# EAGLE design arduino_Uno_Rev3-02-TH (EAGLE 5.10)
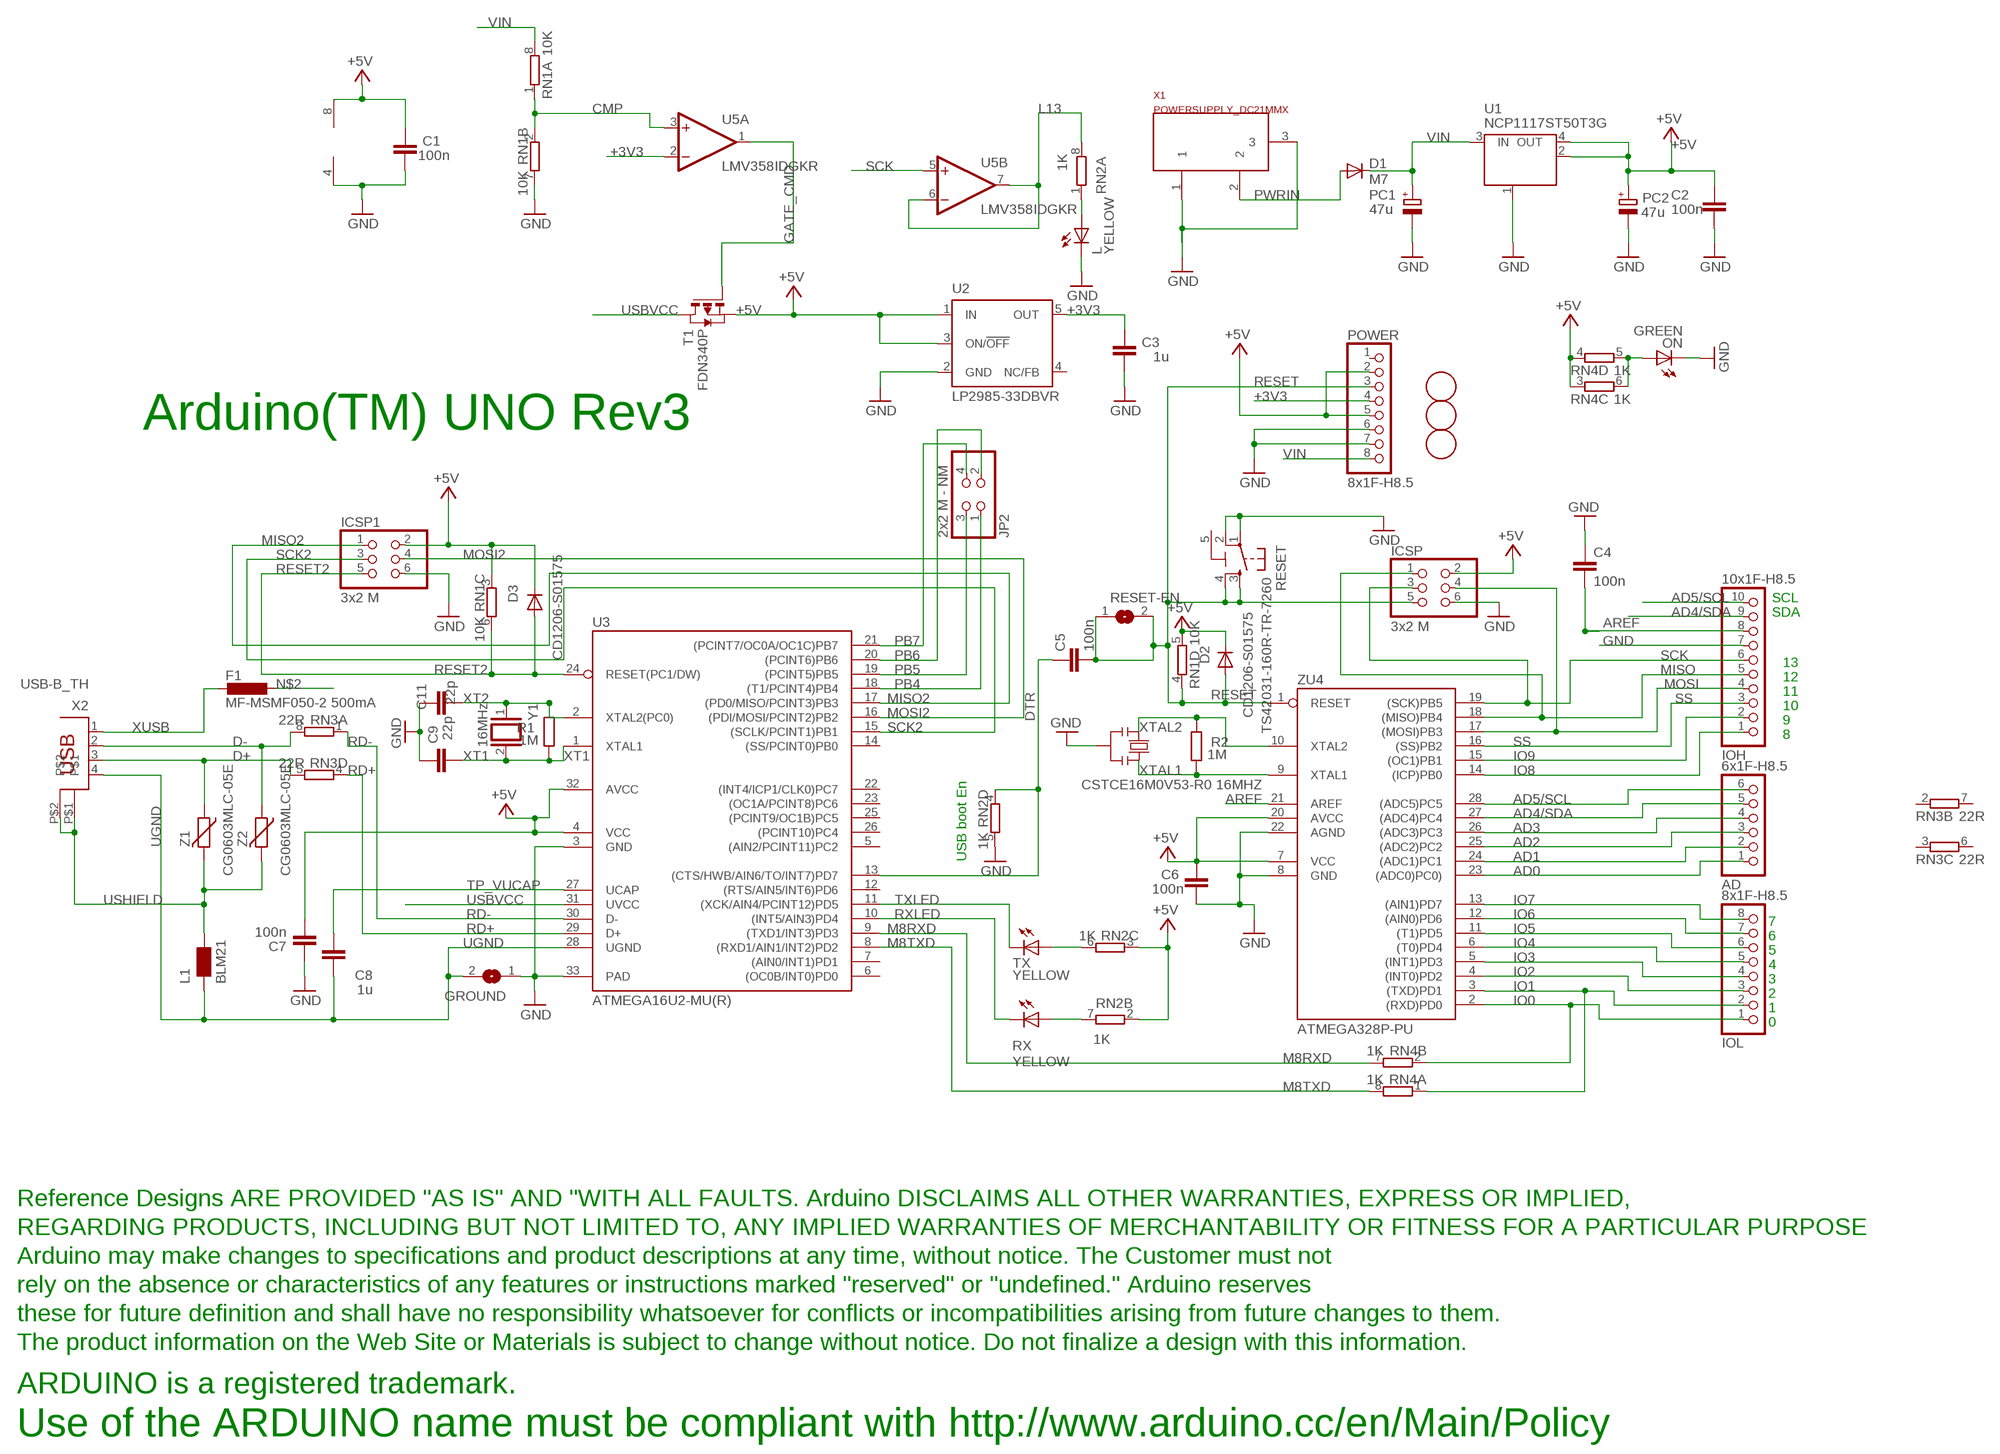
[diagram p0: schematic, sheet 1]

## Parts
AD  6x1F-H8.5  PINHD-1X6  [1X06]
C1  100n  C-EU0603-RND  [C0603-ROUND]
C2  100n  C-EU0603-RND  [C0603-ROUND]
C3  1u  C-EU0603-RND  [C0603-ROUND]
C4  100n  C-EU0603-RND  [C0603-ROUND]
C5  100n  C-EU0603-RND  [C0603-ROUND]
C6  100n  C-EU0603-RND  [C0603-ROUND]
C7  100n  C-EU0603-RND  [C0603-ROUND]
C8  1u  C-EU0603-RND  [C0603-ROUND]
C9  22p  C-EU0603-RND  [C0603-ROUND]
C11  22p  C-EU0603-RND  [C0603-ROUND]
D1  M7  DIODE-SMB  [SMB]
D2  CD1206-S01575  DIODE-MINIMELF  [MINIMELF]
D3  CD1206-S01575  DIODE-MINIMELF  [MINIMELF]
F1  MF-MSMF050-2 500mA  L-EUL1812  [L1812]
FD1  FIDUCIALMOUNT  [FIDUCIA-MOUNT]
FD2  FIDUCIALMOUNT  [FIDUCIA-MOUNT]
FD3  FIDUCIALMOUNT  [FIDUCIA-MOUNT]
GROUND  SJ  [SJ]
ICSP  3x2 M  PINHD-2X3  [2X03]
ICSP1  3x2 M  PINHD-2X3  [2X03]
IOH  10x1F-H8.5  PINHD-1X10_ARD  [1X10]
IOL  8x1F-H8.5  PINHD-1X8  [1X08]
JP2  2x2 M - NM  PINHD-2X2  [2X02]
L  YELLOW  LEDCHIP-LED0805  [CHIP-LED0805]
L1  BLM21  WE-CBF_0805  [0805]
ON  GREEN  LEDCHIP-LED0805  [CHIP-LED0805]
PC1  47u  CPOL-EUD  [PANASONIC_D]
PC2  47u  CPOL-EUD  [PANASONIC_D]
POWER  8x1F-H8.5  PINHD-1X8  [1X08]
R1  1M  R-EU_R0603  [R0603-ROUND]
R2  1M  R-EU_R0603  [R0603-ROUND]
RESET  TS42031-160R-TR-7260  TS42  [TS42]
RESET-EN  SJ  [SJ]
RN1  10K  4R-NCAY16  [CAY16]
RN2  1K  4R-NCAY16  [CAY16]
RN3  22R  4R-NCAY16  [CAY16]
RN4  1K  4R-NCAY16  [CAY16]
RX  YELLOW  LEDCHIP-LED0805  [CHIP-LED0805]
T1  FDN340P  PMOSSOT23  [SOT-23]
TX  YELLOW  LEDCHIP-LED0805  [CHIP-LED0805]
U1  NCP1117ST50T3G  MC33269ST-3.3T3  [SOT223]
U2  LP2985-33DBVR  LP2985-XXDBVR33  [SOT23-DBV]
U3  ATMEGA16U2-MU(R)  ATMEGA16U2-MU  [MLF32]
U5  LMV358IDGKR  LMV358MMX  [MSOP08]
U$1  DISCLAIMER  [DISCLAIMER]
X1  POWERSUPPLY_DC21MMX  [POWERSUPPLY_DC-21MM]
X2  USB-B_TH  PN61729  [PN61729]
Y1  16MHz  XTAL/S  [QS]
Y2  CSTCE16M0V53-R0 16MHZ  RESONATORMU  [RESONATOR]
Z1  CG0603MLC-05E  VARISTORCN0603  [CT/CN0603]
Z2  CG0603MLC-05E  VARISTORCN0603  [CT/CN0603]
ZU4  ATMEGA328P-PU  [DIL28-3]

## Nets
+3V3: C3.2 POWER.4 U2.5(OUT) U5.2(A:-IN)
+5V [usbvcc]: C1.2 C2.2 C6.2 C7.1 D2.C D3.C ICSP1.2 ICSP.2 PC2.+ POWER.2 POWER.5 RN1.3 RN1.5 RN2.2 RN2.3 RN4.3 RN4.4 T1.2(S) U1.2(OUT) U1.4(OUT) U2.1(IN) U2.3(ON/!OFF) U3.4(VCC) U3.32(AVCC) U5.8(P:V+) ZU4.7(VCC) ZU4.20(AVCC)
AD0: AD.1 ZU4.23((ADC0)PC0))
AD1: AD.2 ZU4.24((ADC1)PC1)
AD2: AD.3 ZU4.25((ADC2)PC2)
AD3: AD.4 ZU4.26((ADC3)PC3)
AD4/SDA: AD.5 IOH.9 ZU4.27((ADC4)PC4)
AD5/SCL: AD.6 IOH.10 ZU4.28((ADC5)PC5)
AREF [aref]: C4.2 IOH.8 ZU4.21(AREF)
CMP: RN1.1 RN1.2 U5.3(A:+IN)
D+: RN3.5 X2.3 Z1.1
D-: RN3.8 X2.2 Z2.1
DTR: C5.1 RN2.4 U3.13((CTS/HWB/AIN6/TO/INT7)PD7)
GATE_CMD: T1.3(G) U5.1(A:OUT)
GND [gnd]: C1.1 C2.1 C3.1 C4.1 C6.1 C7.2 C9.2 C11.2 GROUND.1 ICSP1.6 ICSP.6 IOH.7 L.C ON.C PC1.- PC2.- POWER.6 POWER.7 RESET.1 RESET.2 RN1.7 RN2.5 U1.1(GND/ADJ) U2.2(GND) U3.3(GND) U3.33(PAD) U5.4(P:V-) X1.1 X1.3 Y2.2 ZU4.8(GND) ZU4.22(AGND)
IO0: IOL.1 RN4.2 ZU4.2((RXD)PD0)
IO1: IOL.2 RN4.1 ZU4.3((TXD)PD1)
IO2: IOL.3 ZU4.4((INT0)PD2)
IO3: IOL.4 ZU4.5((INT1)PD3)
IO4: IOL.5 ZU4.6((T0)PD4)
IO5: IOL.6 ZU4.11((T1)PD5)
IO6: IOL.7 ZU4.12((AIN0)PD6)
IO7: IOL.8 ZU4.13((AIN1)PD7)
IO8: IOH.1 ZU4.14((ICP)PB0)
IO9: IOH.2 ZU4.15((OC1)PB1)
L13: RN2.8 U5.6(B:-IN) U5.7(B:OUT)
M8RXD: RN4.7 U3.9((TXD1/INT3)PD3)
M8TXD: RN4.8 U3.8((RXD1/AIN1/INT2)PD2)
MISO: ICSP.1 IOH.5 ZU4.18((MISO)PB4)
MISO2: ICSP1.1 U3.17((PD0/MISO/PCINT3)PB3)
MOSI: ICSP.4 IOH.4 ZU4.17((MOSI)PB3)
MOSI2: ICSP1.4 U3.16((PDI/MOSI/PCINT2)PB2)
N$1: L.A RN2.1
N$2 [usbvcc]: F1.1
N$3: ON.A RN4.5 RN4.6
N$35: RN2.7 RX.A
N$36: RN2.6 TX.A
PB4: JP2.1 U3.18((T1/PCINT4)PB4)
PB5: JP2.3 U3.19((PCINT5)PB5)
PB6: JP2.2 U3.20((PCINT6)PB6)
PB7: JP2.4 U3.21((PCINT7/OC0A/OC1C)PB7)
PWRIN [power]: D1.A X1.2
RD+: RN3.4 U3.29(D+)
RD-: RN3.1 U3.30(D-)
RESET: C5.2 D2.A ICSP.5 POWER.3 RESET-EN.1 RESET-EN.2 RESET.3 RESET.4 RN1.4 ZU4.1(RESET)
RESET2: D3.A ICSP1.5 RN1.6 U3.24(RESET(PC1/DW))
RXLED: RX.C U3.10((INT5/AIN3)PD4)
SCK: ICSP.3 IOH.6 U5.5(B:+IN) ZU4.19((SCK)PB5)
SCK2: ICSP1.3 U3.15((SCLK/PCINT1)PB1)
SS: IOH.3 ZU4.16((SS)PB2)
TP_VUCAP: C8.1 U3.27(UCAP)
TXLED: TX.C U3.11((XCK/AIN4/PCINT12)PD5)
UGND [gnd]: C8.2 GROUND.2 L1.1 U3.28(UGND) X2.4
USBVCC [usbvcc]: T1.1(D) U3.31(UVCC)
USHIELD [gnd]: L1.2 X2.P$1 X2.P$2 Z1.2 Z2.2
VIN [power]: D1.C PC1.+ POWER.8 RN1.8 U1.3(IN)
XT1: C9.1 R1.1 U3.1(XTAL1) Y1.2
XT2: C11.1 R1.2 U3.2(XTAL2(PC0)) Y1.1
XTAL1: R2.1 Y2.3 ZU4.9(XTAL1)
XTAL2: R2.2 Y2.1 ZU4.10(XTAL2)
XUSB [usbvcc]: F1.2 X2.1
Unconnected: POWER.1 RN3.2 RN3.3 RN3.6 RN3.7 U2.4(NC/FB) U3.5((AIN2/PCINT11)PC2) U3.6((OC0B/INT0)PD0) U3.7((AIN0/INT1)PD1) U3.12((RTS/AIN5/INT6)PD6) U3.14((SS/PCINT0)PB0) U3.22((INT4/ICP1/CLK0)PC7) U3.23((OC1A/PCINT8)PC6) U3.25((PCINT9/OC1B)PC5) U3.26((PCINT10)PC4)

## Notes on the sheet
- Arduino(TM) UNO Rev3
- SCL
- SDA
- 13
- 12
- 11
- 10
- 9
- 8
- USB boot En
- 7
- 6
- 5
- 4
- 3
- 2
- 1
- 0
- Use of the ARDUINO name must be compliant with http://www.arduino.cc/en/Main/Policy

## Power pins joined to a net without a drawn wire
5-GND: RESET.5(5-GND)

## Library data of the parts
AD = SmartPrj:PINHD-1X6: PIN HEADER
C1-C9 C11 = SmartPrj:C-EU: CAPACITOR, European symbol
D1-D3 = diode:DIODE-: DIODE
F1 = rcl:L-EU: INDUCTOR, European symbol
FD1-FD3 = SmartPrj:FIDUCIALMOUNT
GROUND RESET-EN = jumper:SJ: SMD solder JUMPER
ICSP ICSP1 = SmartPrj:PINHD-2X3: PIN HEADER
IOH = SmartPrj:PINHD-1X10_ARD: PIN HEADER
IOL POWER = SmartPrj:PINHD-1X8: PIN HEADER
JP2 = SmartPrj:PINHD-2X2: PIN HEADER
L ON RX TX = led:LED: LED OSRAM: - CHIPLED LG R971, LG N971, LY N971, LG Q971, LY Q971, LO R971, LY R971 LH N974, LH R974 LS Q976, LO Q976, LY Q976 LO Q996 - Hyper CHIPLED LW Q18S LB Q993, LB Q99A, LB R99A - SideLED LS A670, LO A670, LY A670, LG A670, LP A670 LB A673, LV A673, LT A673, LW A673 LH A674 LY A675 LS A676, LA A676, LO A676, LY A676, LW A676 LS A679, LY A679, LG A679 - Hyper Micro SIDELED® LS Y876, LA Y876, LO Y876, LY Y876 LT Y87S - SmartLED LW L88C, LW L88S LB L89C, LB L89S, LG L890 LS L89K, LO L89K, LY L89K LS L896, LA L896, LO L896, LY L896 - TOPLED LS T670, LO T670, LY T670, LG T670, LP T670 LSG T670, LSP T670, LSY T670, LOP T670, LYG T670 LG T671, LOG T671, LSG T671 LB T673, LV T673, LT T673, LW T673 LH T674 LS T676, LA T676, LO T676, LY T676, LB T676, LH T676, LSB T676, LW T676 LB T67C, LV T67C, LT T67C, LS T67K, LO T67K, LY T67K, LW E67C LS E67B, LA E67B, LO E67B, LY E67B, LB E67C, LV E67C, LT E67C LW T67C LS T679, LY T679, LG T679 LS T770, LO T770, LY T770, LG T770, LP T770 LB T773, LV T773, LT T773, LW T773 LH T774 LS E675, LA E675, LY E675, LS T675 LS T776, LA T776, LO T776, LY T776, LB T776 LHGB T686 LT T68C, LB T68C - Hyper Mini TOPLED® LB M676 - Mini TOPLED Santana® LG M470 LS M47K, LO M47K, LY M47K Source: http://www.osram.convergy.de LUXEON: - LUMILED® LXK2-PW12-R00, LXK2-PW12-S00, LXK2-PW14-U00, LXK2-PW14-V00 LXK2-PM12-R00, LXK2-PM12-S00, LXK2-PM14-U00 LXK2-PE12-Q00, LXK2-PE12-R00, LXK2-PE12-S00, LXK2-PE14-T00, LXK2-PE14-U00 LXK2-PB12-K00, LXK2-PB12-L00, LXK2-PB12-M00, LXK2-PB14-N00, LXK2-PB14-P00, LXK2-PB14-Q00 LXK2-PR12-L00, LXK2-PR12-M00, LXK2-PR14-Q00, LXK2-PR14-R00 LXK2-PD12-Q00, LXK2-PD12-R00, LXK2-PD12-S00 LXK2-PH12-R00, LXK2-PH12-S00 LXK2-PL12-P00, LXK2-PL12-Q00, LXK2-PL12-R00 Source: www.luxeon.com KINGBRIGHT: KA-3528ASYC Source: www.kingbright.com
L1 = wuerth-elektronik:WE-CBF: SMD EMI Suppression Ferrite Beads - excellent anti-EMI properties - low DCR - impedances till 3000 ohms - rated current up to 6 A
PC1 PC2 = rcl:CPOL-EU: POLARIZED CAPACITOR, European symbol
R1 R2 = SmartPrj:R-EU_: RESISTOR, European symbol
RESET = SmartPrj:TS42: TS42 Dongnan Electronics Tact switch VDC 12V - 50mA
RN1-RN4 = resistor-dil:4R-N: Array Chip Resistor Source: RS Component / Phycomp
T1 = zetex:PMOSSOT23: MOS FET
U1 = linear:MC33269ST*: Adjustable Output Low Dropout Voltage Regulator 800 mA Source: http://www.onsemi.com/pub/Collateral/MC33269-D.PDF
U2 = SmartPrj:LP2985-XXDBVR: ULTRALOW-POWER 50-mA LOW-DROPOUT LINEAR REGULATORS 50-mA Low-Dropout Regulator Source: http://focus.ti.com/lit/ds/symlink/tps77001.pdf
U3 = SmartPrj:ATMEGA16U2-
U5 = linear:LMV358?*: Dual General Purpose, Low Voltage, Rail-to-Rail Output Operational Amplifiers Source: http://www.national.com/mpf/LM/LMV321.html http://www.national.com/dt/lmv_qual.pdf
U$1 = SmartPrj:DISCLAIMER
X1 = SmartPrj:POWERSUPPLY_DC21MM
X2 = SmartPrj:PN61729: BERG USB connector
Y1 = SmartPrj:XTAL/S: CRYSTAL
Y2 = SmartPrj:RESONATOR
Z1 Z2 = varistor:VARISTOR: VARISTOR
ZU4 = SmartPrj:ATMEGA328P-: MICROCONTROLLER 4 Kbytes FLASH 128 bytes SRAM 256 bytes EEPROM UART 6-channel 10 bit ADC

## Net classes
0 default: width 0.254 mm, clearance 0.254 mm
1 power: width 0.61 mm, drill 0.61 mm, clearance 0.254 mm
2 gnd: width 0.305 mm, drill 0.559 mm, clearance 0.254 mm
3 usbvcc: width 0.508 mm, drill 0.61 mm, clearance 0.254 mm
4 aref: width 0.406 mm, drill 0.61 mm, clearance 0.254 mm

## Board
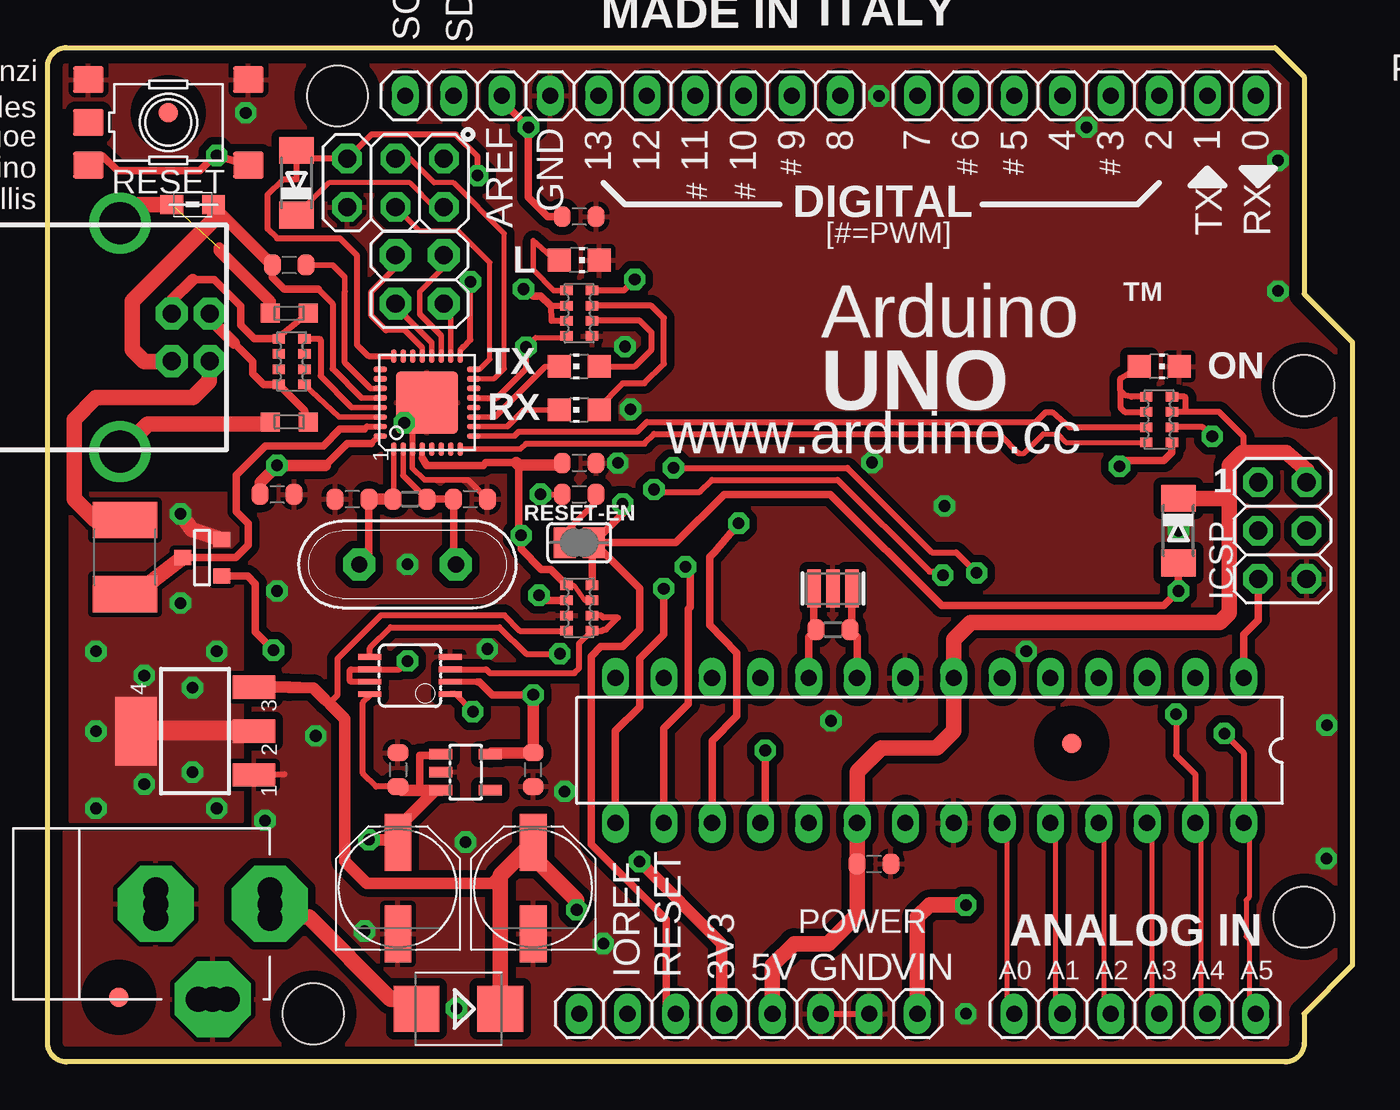
[diagram p1: board, top side]
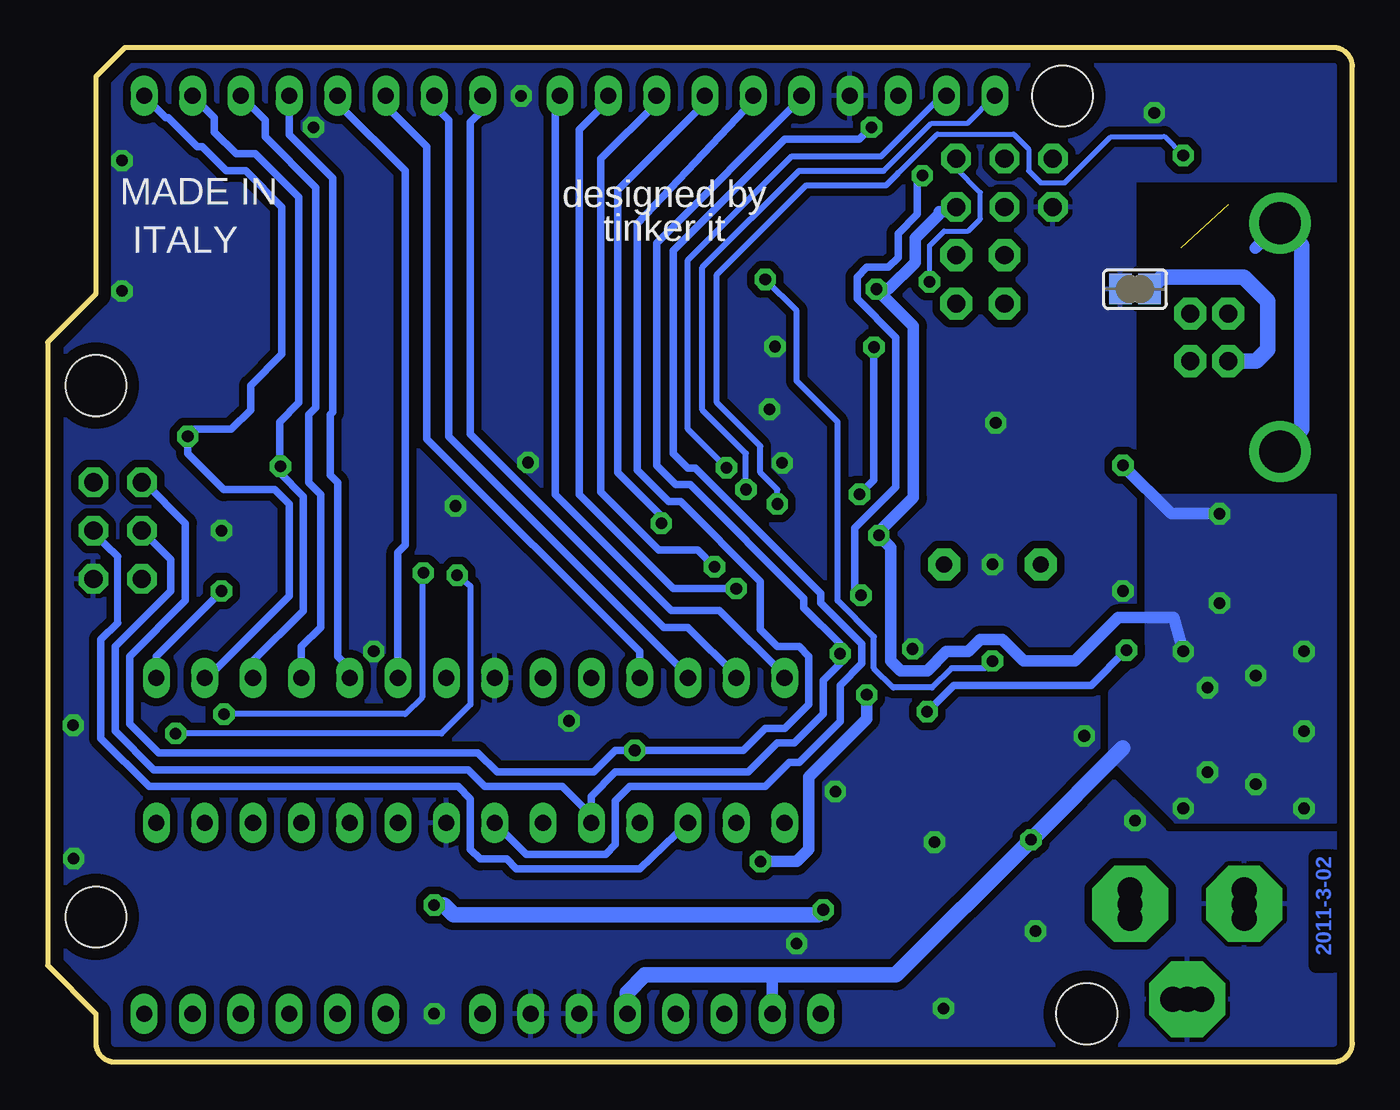
[diagram p2: board, bottom side, seen from below]

Size 68.58 x 53.34 mm. Coordinates in mm from the lower left corner, seen from the top.
Outline: 64.52,53.34 66.04,51.82 66.04,40.39 68.58,37.85 68.58,5.08 66.04,2.54 66.04,1 arc-90 65.04,0 1,0 arc-90 0,1 0,52.34 arc-90 1,53.34 64.52,53.34
Copper layers (1*16): Top 0.035mm / dielectric 1.5mm / Bottom 0.035mm
Design rules "ArduinoUno *": minimum track width 10mil, minimum drill 22mil, track to track 10mil, track to pad 10mil, pad to pad 10mil, via to via 12mil, smd to smd 8mil, copper to edge 26mil, drill to drill 12mil, minimum pad ring 10mil, minimum via ring 10mil, stop-mask expansion 1mil, vias tented up to drill 30mil, thermal gap 10mil
Holes 3.2 mm at 66.04,35.56 66.04,7.62 15.24,50.8 13.97,2.54
vRestrict: area 22.9,44.1 to 24.6,49.1; area 25.4,45.5 to 27.1,49.1; area 28.4,45.3 to 29.6,48.8; area 31,45.3 to 32.1,48.8; area 33.5,45.3 to 34.7,48.8; area 36.1,45.3 to 37.2,48.8; area 38.7,47.2 to 39.9,48.8; area 40.3,45.1 to 47.6,46.9; area 60.3,44.2 to 61.7,46.7; area 62.9,44.2 to 64.3,46.7; area 61.3,35.8 to 64.8,37.2; area 0.6,21.8 to 2,30.1; area 5.7,22.6 to 7.4,30.1; area 47.9,10.3 to 48.5,10.8; area 50.4,10.2 to 50.9,11; area 11.3,28.8 to 12.7,31.1; area 44.8,47.5 to 46.1,48.9; area 47.6,47.4 to 48.8,48.9; area 50.2,47.4 to 51.3,48.9; area 52.8,47.4 to 54,48.9; area 55.2,47.4 to 56.4,48.9; area 57.9,47.4 to 59.1,48.9; area 60.5,47.4 to 61.6,48.9; area 63,47.4 to 64.1,48.9; area 41.3,47.2 to 42.4,48.8; area 0.3,12.4 to 9.4,24.5

### Footprints (pad centres in the part's own frame; a part is rotated, then mirrored left to right if it is on the bottom)
1X06 = drill 0.85 pad 1.422 long: 1 -6.35,0; 2 -3.81,0; 3 -1.27,0; 4 1.27,0; 5 3.81,0; 6 6.35,0
C0603-ROUND = smd 0.898 x 1.1: 1 -0.889,0; 2 0.889,0
SMB = smd 2.4 x 2.4: A 2.2,0; C -2.2,0
MINIMELF = smd 1.4 x 1.8: A 1.7,0; C -1.7,0
L1812 = smd 1.9 x 3.4: 1 -1.95,0; 2 1.95,0
FIDUCIA-MOUNT = smd 1.016 x 1.016: P$1 0,0
SJ = smd 1.168 x 1.6: 1 -0.762,0; 2 0.762,0
2X03 = drill 0.95 pad 1.55 octagon: 1 -2.54,-1.27; 2 -2.54,1.27; 3 0,-1.27; 4 0,1.27; 5 2.54,-1.27; 6 2.54,1.27
1X10@1 = drill 0.85 pad 1.422 long: 1 -11.43,0; 2 -8.89,0; 3 -6.35,0; 4 -3.81,0; 5 -1.27,0; 6 1.27,0; 7 3.81,0; 8 6.35,0; 9 8.89,0; 10 11.43,0
1X08 = drill 0.85 pad 1.422 long: 1 -8.89,0; 2 -6.35,0; 3 -3.81,0; 4 -1.27,0; 5 1.27,0; 6 3.81,0; 7 6.35,0; 8 8.89,0
2X02 = drill 0.95 pad 1.676 octagon: 1 -1.27,-1.27; 2 -1.27,1.27; 3 1.27,-1.27; 4 1.27,1.27
CHIP-LED0805 = smd 1.2 x 1.2: A 0,-1.05; C 0,1.05
0805 = smd 1.2 x 1: 1 -1.1,0; 2 1.1,0
PANASONIC_D = smd 3 x 1.4: + 2.4,0; - -2.4,0
R0603-ROUND = smd 0.898 x 1.1: 1 -0.889,0; 2 0.889,0
TS42 = smd 1.6 x 1.4: 1 -4.2,2.25; 2 4.2,2.25; 3 -4.2,-2.25; 4 4.2,-2.25; 5 -4.2,0
CAY16 = smd 0.5 x 0.65: 1 -1.2,-0.675; 2 -0.4,-0.675; 3 0.4,-0.675; 4 1.2,-0.675; 5 1.2,0.675; 6 0.4,0.675; 7 -0.4,0.675; 8 -1.2,0.675
SOT-23 = smd 0.787 x 0.889: 1 0.025,-1.016; 2 -0.94,1.016; 3 0.991,1.016
SOT223 = smd 1.219 x 2.235: 1 -2.311,-3.099; 2 0,-3.099; 3 2.311,-3.099 | smd 3.6 x 2.2: 4 0,3.099
SOT23-DBV = smd 0.55 x 1.2: 1 -0.95,-1.3; 2 0,-1.3; 3 0.95,-1.3; 4 0.95,1.3; 5 -0.95,1.3
MLF32 = smd 0.7 x 0.28: 1 -2.45,1.75; 2 -2.45,1.25; 3 -2.45,0.75; 4 -2.45,0.25; 5 -2.45,-0.25; 6 -2.45,-0.75; 7 -2.45,-1.25; 8 -2.45,-1.75; 17 2.45,-1.75; 18 2.45,-1.25; 19 2.45,-0.75; 20 2.45,-0.25; 21 2.45,0.25; 22 2.45,0.75; 23 2.45,1.25; 24 2.45,1.75 | smd 0.28 x 0.7: 9 -1.75,-2.45; 10 -1.25,-2.45; 11 -0.75,-2.45; 12 -0.25,-2.45; 13 0.25,-2.45; 14 0.75,-2.45; 15 1.25,-2.45; 16 1.75,-2.45; 25 1.75,2.45; 26 1.25,2.45; 27 0.75,2.45; 28 0.25,2.45; 29 -0.25,2.45; 30 -0.75,2.45; 31 -1.25,2.45; 32 -1.75,2.45 | smd 3.254 x 3.254: 33 0,0
MSOP08 = smd 0.3 x 1.2: 1 -0.976,-2.113; 2 -0.326,-2.113; 3 0.324,-2.113; 4 0.974,-2.113; 5 0.974,2.112; 6 0.324,2.112; 7 -0.326,2.112; 8 -0.976,2.112
POWERSUPPLY_DC-21MM = drill 1.3 pad 4 octagon: 1 -5.08,-3.353; 2 -0.076,-6.35; 3 -0.076,-0.356 | drill 1.3 round: 4 -5.08,-4.115; 5 -5.08,-2.591; 6 -0.838,-0.356; 7 0.686,-0.356; 8 -0.838,-6.35; 9 0.686,-6.35
PN61729 = drill 0.95 pad 1.676 octagon: 1 1.25,4.71; 2 -1.25,4.71; 3 -1.25,2.71; 4 1.25,2.71 | drill 2.2 round: P$1 -6,0; P$2 6,0
QS = drill 0.85 pad 1.676 octagon: 1 -2.54,0; 2 2.54,0
RESONATOR = smd 0.7 x 2: 1 -1,0; 2 0,0; 3 1,0
CT/CN0603 = smd 1 x 1: 1 -1,0; 2 1,0
DIL28-3 = drill 0.85 pad 1.422 long: 1 -16.51,-3.81; 2 -13.97,-3.81; 3 -11.43,-3.81; 4 -8.89,-3.81; 5 -6.35,-3.81; 6 -3.81,-3.81; 7 -1.27,-3.81; 8 1.27,-3.81; 9 3.81,-3.81; 10 6.35,-3.81; 11 8.89,-3.81; 12 11.43,-3.81; 13 13.97,-3.81; 14 16.51,-3.81; 15 16.51,3.81; 16 13.97,3.81; 17 11.43,3.81; 18 8.89,3.81; 19 6.35,3.81; 20 3.81,3.81; 21 1.27,3.81; 22 -1.27,3.81; 23 -3.81,3.81; 24 -6.35,3.81; 25 -8.89,3.81; 26 -11.43,3.81; 27 -13.97,3.81; 28 -16.51,3.81

### Placement (x,y rotation side)
AD  57.15,2.54 0 top
C1  18.41,15.37 270 top
C2  12.06,29.84 180 top
C3  25.53,15.37 90 top
C4  27.94,44.45 180 top
C5  27.94,29.84 0 top
C6  43.43,10.41 180 top
C7  27.94,31.5 0 top
C8  12.7,41.91 180 top
C9  16,29.59 180 top
C11  22.23,29.59 0 top
D1  21.59,2.79 180 top
D2  59.44,27.94 270 top
D3  13.08,46.23 90 top
F1  4.06,26.54 90 top
FD1  6.35,49.91 0 top
FD2  53.84,16.74 0 top
FD3  3.73,3.41 0 top
GROUND  11.43,40.64 0 bottom
ICSP  64.9,27.94 270 top
ICSP1  18.29,46.23 180 top
IOH  10x1F-H8.5  [1X10@1]  30.23,50.8 180 top
IOL  54.61,50.8 180 top
JP2  19.56,41.15 90 top
L  27.94,42.16 270 top
L1  7.62,45.09 180 top
ON  58.42,36.58 270 top
PC1  25.53,9.14 90 top
PC2  18.41,9.14 90 top
POWER  36.83,2.54 0 top
R1  19.05,29.59 0 top
R2  41.27,22.73 180 top
RESET  6.35,49.4 0 top
RESET-EN  27.94,27.3 0 top
RN1  27.94,23.88 90 top
RN2  27.94,39.37 270 top
RN3  12.83,36.83 90 top
RN4  58.42,33.78 90 top
RX  27.94,34.29 90 top
T1  8.13,26.54 270 top
TX  27.94,36.58 90 top
U1  7.75,17.4 90 top
U2  21.97,15.24 270 top
U3  19.94,34.67 90 top
U5  19.05,20.32 90 top
U$1  -20.19,-23.37 0 top  (outside the outline)
X1  5.33,8.38 90 top
X2  3.81,38.1 270 top
Y1  18.92,26.16 180 top
Y2  41.27,24.89 0 top
Z1  12.7,39.37 180 top
Z2  12.7,33.66 180 top
ZU4  46.35,16.38 180 top

### Tracks (layer width: path | path; a pad name or v marks a point on that pad's centre or on a via)
+3V3  (via drill 0.61)
  Top 0.305: 22.61,19.99 U5.2
  Top 0.406: 22.61,19.99 22.68,19.99 23.37,19.3 v25.53,19.3
  Top 0.61: v31.11,10.54 35.43,6.22 35.43,2.67 POWER.4 | U2.5 23.34,16.26 C3.2 v25.53,19.3
  Bottom 0.61: v31.11,10.54 29.21,10.54 28.57,11.18 28.57,14.99 25.53,18.03 v25.53,19.3
+5V  (via drill 0.61)
  Top 0.254: 27.32,25.02 RN1.5 27.65,25.08 28.23,24.28 RN1.3 | ICSP1.2 20.32,44.96 19.05,46.23 14.78,46.23 D3.C
  Top 0.305: 59.82,34.18 61.58,34.18 62.87,32.89 62.87,32.05 | 59.82,34.18 RN4.3 | RN4.4 59.76,34.98 59.82,34.92 59.82,34.18 | RN2.2 26.43,39.77 26.47,38.97 RN2.3 | 19.69,31.75 U3.4 | U3.32 17.43,32.92 17.02,32.51 | U5.8 16.98,19.3 16.57,18.9 16.57,15.18 17.27,14.48 C1.2
  Top 0.406: 42.55,10.16 42.35,10.35 | 26.43,39.77 25.93,40.28 25.53,40.26 v25.02,40.64 | RN1.5 26.43,25.91 25.96,25.91 24.89,26.97 v24.89,27.69 24.77,28.19 24.77,31.38 | 24.64,31.51 23.03,31.51 22.89,31.37 19.94,31.37 19.69,31.75 | 17.02,32.51 15.75,32.51 14.61,31.37 | U2.1 20.61,16.13 19.56,16.13 19.56,14.29
  Top 0.508: 11.02,17.42 U1.2 | ICSP.2 66.04,30.48
  Top 0.61: C6.2 42.58,10.88 42.55,11.43 | 24.64,31.51 24.77,31.38 26.94,31.38 C7.1 | 11.05,29.72 C2.2 11.18,30.48 v12.06,31.37 14.61,31.37 | v16.89,11.68 18.78,11.68 PC2.+ 18.41,12.32 20.39,14.29 U2.3 19.56,14.29 18.6,14.29 C1.2
  Top 0.813: 66.17,30.44 ICSP.2 66.17,31.11 65.1,32.05 62.87,32.05 62.79,32.05 62.1,31.37 62.1,29.46 | 62.1,29.46 62.1,23.62 61.59,23.11 48.51,23.11 47.62,22.23 ZU4.7 47.62,17.4 46.74,16.51 43.81,16.51 42.55,15.24 ZU4.20 42.55,11.43 C6.2 42.55,10.16 42.55,7.75 41.02,6.22 39.24,6.22 38.1,5.08 POWER.5 | T1.2 7.57,27.99 v6.99,28.83 | D2.C 61.93,29.64 62.1,29.46
  Top 1.016: U1.4 5.84,17.4 5.87,17.42 11.02,17.42
  Bottom 0.61: ICSP1.2 21.08,44.7 21.72,44.7 21.72,44.58 22.99,43.31 22.99,42.04 24.38,40.64 v25.02,40.64 23.07,38.69 23.07,29.68 24.89,27.85 v24.89,27.69 24.26,27.05 24.26,21.08 23.75,20.57 22.35,20.57 21.34,21.59 20.19,21.59 19.56,22.23 18.41,22.23 17.27,21.08 14.61,21.08 12.32,23.37 9.4,23.37 v8.89,21.59 | POWER.2 30.48,4.7 30.61,4.57 | v12.06,31.37 9.53,28.83 v6.99,28.83
  Bottom 0.813: POWER.5 38.12,3.63 37.19,4.57 30.61,4.57 24,4.57 v16.89,11.68 12.06,16.51
  other vias: 2.54,21.59 5.08,20.32 6.99,24.13 2.54,13.34 5.08,14.61 2.54,17.4 8.89,13.34 7.62,15.24 7.62,19.68
  pour Bottom (isolate 0.406, no thermals): 0.89,29.72 10.79,29.72 10.79,21.34 12.7,19.43 12.7,16.13 9.27,12.7 0.89,12.7
  pour Top (no thermals): 1.27,12.7 1.27,29.84 10.16,29.84 10.16,12.7
AD0
  Top 0.254: ZU4.23 50.44,12.17 50.44,3 AD.1
AD1
  Top 0.254: ZU4.24 52.98,12.17 52.98,3 AD.2
AD2
  Top 0.254: ZU4.25 55.52,12.17 55.52,3 AD.3
AD3
  Top 0.254: ZU4.26 58.06,12.17 58.06,3 AD.4
AD4/SDA  (via drill 0.61)
  Top 0.254: ZU4.27 60.6,12.17 60.6,3 AD.5
  Top 0.305: v32.89,31.24 42.04,31.24 46.48,26.8 47.75,26.8 v48.83,25.72 49.02,25.65 | v59.31,18.29 59.31,16.13 60.33,15.11 ZU4.27
  Bottom 0.305: IOH.9 21.59,50.8 24.77,47.62 29.46,47.62 34.92,42.16 34.92,33.27 v32.89,31.24 | v48.83,25.72 48.9,25.65 48.9,19.18 49.78,18.29 v59.31,18.29
AD5/SCL  (via drill 0.61)
  Top 0.254: ZU4.28 63.14,12.17 63.14,8.66 62.99,8.51 62.99,6.6 63.14,6.45 63.14,3 AD.6
  Top 0.305: v31.88,30.1 31.88,29.97 34.29,29.97 34.92,30.61 41.53,30.61 46.35,25.78 46.86,25.78 v47.05,25.59 | ZU4.28 62.87,16.26 v61.85,17.27
  Bottom 0.254: IOH.10 20.22,49.35 22.12,49.35 24.64,46.86
  Bottom 0.305: v61.85,17.27 47.88,17.27 46.35,18.8 46.35,25.02 v47.05,25.59 | v31.88,30.1 31.88,32 34.16,34.29 34.16,41.78 29.08,46.86 24.64,46.86
AREF  (via drill 0.61)
  Top 0.406: IOH.8 23.88,50.55 v25.27,49.15 25.27,45.47 26.29,44.45 C4.2
  Bottom 0.406: ZU4.21 43.43,10.92 39.24,10.92 38.73,11.43 38.73,13.72 37.97,14.48 30.86,14.48 29.59,15.75 29.08,15.75 26.92,17.91 26.92,19.81 25.78,20.95 25.78,21.97 27.94,24.13 27.94,24.64 34.54,31.24 34.92,31.24 35.69,32 35.69,42.67 29.84,48.51 25.91,48.51 v25.27,49.15
CMP
  Top 0.305: U5.3 23.04,20.64 23.24,20.45 27.69,20.45 27.94,20.7 27.94,22 RN1.1 29.15,22.68 29.21,22.73 29.34,22.73 29.97,23.37 29.21,23.37 29.1,23.48 RN1.2
D+
  Top 0.305: Z1.1 12.1,38.1 RN3.5
  Top 0.406: 7.62,41.15 8.76,41.15 10.16,39.75 10.16,38.73 10.87,38.03 RN3.5
  Top 0.61: X2.3 6.52,40.05 7.62,41.15
  Bottom 0.61: X2.3 6.5,39.37
D-
  Top 0.406: 9.82,37.81 10.79,36.83 10.79,36.2 11.36,35.63 RN3.8 13.49,34.29 Z2.1
  Top 0.61: X2.2 8.53,39.1 9.82,37.81
  Bottom 0.305: X2.2
DTR  (via drill 0.61)
  Top 0.254: v25.15,37.59 25.65,38.1 27.2,38.1
  Top 0.305: 26.42,29.84 C5.1 | 27.2,38.1 RN2.4 | U3.13 23.62,34.92 25.15,36.45 v25.15,37.59
  Top 0.406: v25.91,29.84 26.42,29.84
  Bottom 0.406: v25.15,37.59 25.15,30.61 v25.91,29.84
GATE_CMD  (via drill 0.61)
  Top 0.305: U5.1 21.42,19.34 v22.35,18.41
  Top 0.406: T1.3 10.52,25.55 10.92,25.15 10.92,22.61 11.62,21.91 v11.87,21.65 12.06,21.46
  Bottom 0.406: v22.35,18.41 20.95,19.81 13.72,19.81 v11.87,21.65
GND  (via drill 0.61)
  Top 0.279: C11.2 22.1,30.61 19.81,30.61 19.18,31.24 19.18,32.26
  Top 0.305: POWER.6 POWER.7 | U1.1 12.45,15.14 | U3.3 19.19,33.52 v18.75,33.6 U3.33
  Bottom 0.305: GROUND.1 10.79,40.64
  other vias: 29.21,6.22 27.18,14.22 16.66,6.88 30.63,34.32 54.61,49.15 30.35,37.62 11.43,12.7 41.17,17.93 51.44,21.59 29.97,31.5 43.69,50.8 48.26,2.54 59.44,27.94 21.49,2.82 67.21,10.69 64.67,47.4 12.06,24.77 67.23,17.7 23.11,21.72 10.41,49.91 47.14,29.24 18.92,26.16 43.33,31.52 21.97,11.56 14.1,17.14 64.67,40.54
  pour Bottom (isolate 0.406, rank 2): 0.64,52.7 67.69,52.7 67.94,52.45 67.94,0.64 0.89,0.64 0.64,0.89 0.64,30.1 11.43,30.1 11.43,46.35 0.64,46.35
  pour Top (isolate 0.406, rank 2): 0.64,52.7 67.94,52.7 67.94,0.64 0.64,0.64 0.51,30.48 11.43,30.48 11.43,46.35 0.64,46.35
IO0  (via drill 0.61)
  Top 0.305: RN4.2 60.73,33.38 v61.21,32.89
  Bottom 0.406: ZU4.2 60.2,20.19 55.88,24.51 55.88,29.34 56.64,30.1 59.31,30.1 61.21,32 v61.21,32.89 60.83,33.27 58.93,33.27 57.91,34.29 57.91,35.56 56.26,37.21 56.26,44.96 58.17,46.86 59.18,46.86 60.45,48.13 60.71,48.13 62.23,49.66 62.36,49.66 IOL.1
IO1  (via drill 0.61)
  Top 0.406: RN4.1 59.09,32.04 58.67,31.62 56.64,31.62 v56.34,31.32
  Bottom 0.406: ZU4.3 57.78,21.08 55.14,23.72 55.14,29.74 56.39,30.99 56.39,31.11 v56.34,31.32 56.39,31.37 56.39,33.66 55.37,34.67 55.37,45.47 57.66,47.75 58.67,47.75 59.82,48.9 59.82,49.66 IOL.2
IO2
  Bottom 0.406: ZU4.4 55.24,21.84 54.23,22.86 54.23,29.84 54.86,30.48 54.86,34.04 54.48,34.42 54.48,45.97 57.15,48.64 57.15,49.53 IOL.3
IO3
  Bottom 0.406: ZU4.5 52.7,20.7 53.34,21.34 53.34,30.48 53.72,30.86 53.72,34.04 53.59,34.16 53.59,46.48 55.88,48.77 IOL.4
IO4
  Bottom 0.406: IOL.5 53.21,50.29 49.78,46.86 49.78,27.18 50.16,26.8 ZU4.6
IO5
  Bottom 0.406: IOL.6 50.8,50.29 48.64,48.13 48.64,32.77 37.47,21.59 ZU4.11
IO6
  Bottom 0.406: IOL.7 48.26,50.29 47.5,49.53 47.5,32.89 34.92,20.32 ZU4.12
IO7
  Bottom 0.406: IOL.8 45.72,50.04 46.35,49.4 46.35,33.02 36.2,22.86 34.92,22.86 32.38,20.32 ZU4.13
IO8
  Bottom 0.406: ZU4.14 29.84,20.32 33.27,23.75 35.81,23.75 41.91,29.84 41.91,50.55 41.66,50.29 IOH.1
IO9  (via drill 0.61)
  Top 0.406: ZU4.15 29.84,17.4 31.11,18.67 31.11,21.21 32.38,22.48 v32.38,24.89
  Bottom 0.406: v32.38,24.89 35.69,24.89 40.64,29.84 40.64,49.02 39.12,50.55 IOH.2
L13  (via drill 0.61)
  Top 0.305: U5.7 15.95,19.99 15.88,20.07 15.88,20.57 15.95,20.64 U5.6 18.48,20.64 18.54,20.7 v18.92,21.08 | RN2.8 30.28,40.57 v30.86,41.15
  Bottom 0.305: v30.86,41.15 29.21,39.5 29.21,35.81 27.05,33.66 27.05,24.26 25.15,22.35 25.15,20.7 24.13,19.68 22.1,19.68 21.08,20.7 19.3,20.7 v18.92,21.08
M8RXD
  Top 0.279: U3.9 24.54,32.92 24.77,33.15
  Top 0.305: RN4.7 53.7,33.38 52.79,34.16 52.45,34.16 51.94,33.66 31.5,33.66 30.99,33.15 24.77,33.15
M8TXD
  Top 0.254: RN4.8 53.52,32.58 53.09,33.02 52.32,33.02 51.31,32 51.05,32
  Top 0.279: U3.8 24.86,32.22 25.15,32.51
  Top 0.305: 25.15,32.51 31.37,32.51 31.88,33.02 50.04,33.02 51.05,32
MISO  (via drill 0.61)
  Top 0.406: v37.72,16.38 37.72,12.83 ZU4.18
  Bottom 0.406: IOH.5 31.5,50.55 37.59,44.07 37.59,31.11 35.94,29.46 35.31,29.46 31.11,25.27 31.11,22.73 30.23,21.84 29.08,21.84 28.57,21.34 28.57,18.8 29.84,17.53 30.86,17.53 32,16.38 v37.72,16.38 | ICSP.1 63.45,30.43 61.34,28.32 61.34,24.26 64.26,21.34 64.26,17.78 62.74,16.26 45.97,16.26 44.96,15.24 39.88,15.24 38.73,16.38 v37.72,16.38 | v37.72,16.38 37.85,16.13 37.85,16.26
MISO2  (via drill 0.61)
  Top 0.254: v22.23,41.02 22.23,39.5
  Top 0.279: 21.84,37.59 21.69,37.44 U3.17
  Top 0.305: v22.23,41.02 22.23,37.97 21.84,37.59
  Bottom 0.254: v22.23,41.02 22.23,42.93 21.46,43.69 20.19,43.69 19.56,44.32 19.56,45.72 20.83,46.99 ICSP1.1
MOSI  (via drill 0.61)
  Top 0.406: ZU4.17 34.92,16.89 36.22,18.19 36.22,21.51 34.8,22.99 34.8,26.54 35.05,26.8 v36.32,28.32
  Bottom 0.381: 64.9,23.09 64.9,26.57
  Bottom 0.406: IOH.4 34.04,50.42 38.61,45.85 38.61,30.99 36.32,28.7 v36.32,28.32 | ICSP.4 66.18,27.83 64.9,26.57 | 64.9,23.09 65.79,22.23 65.79,17.02 63.25,14.48 46.99,14.48 46.35,13.84 46.35,11.18 45.85,10.67 44.45,10.67 43.94,10.16 37.47,10.16 ZU4.17
MOSI2
  Top 0.254: ICSP1.4 19.56,43.69 21.59,43.69 23.24,42.04 23.24,36.96 22.7,36.42 U3.16
N$1
  Top 0.279: RN2.1 26.61,40.57 25.53,41.66 25.53,43.18 26.67,42.16 L.A
N$3
  Top 0.305: RN4.6 56.62,34.18 56.39,34.42 56.39,35.31 | 56.39,35.31 56.39,35.94 ON.A | RN4.5 56.97,34.98 56.64,35.05 56.39,35.31
N$35
  Top 0.305: RX.A 28.96,34.29 28.96,34.42 30.23,35.69 31.37,35.69 32.38,36.7 32.38,39.12 31.73,39.77 RN2.7
N$36
  Top 0.305: TX.A 29.25,36.57 30.86,36.57 31.75,37.47 31.75,38.35 31.37,38.73 31.13,38.97 RN2.6
PB4
  Top 0.279: U3.18 21.19,39.52
  Top 0.305: 21.19,39.52 JP2.1
PB5
  Top 0.279: 20.83,41.78 19.56,40.51 19.56,39.32 20.69,38.19 U3.19
  Top 0.305: 20.83,41.78 JP2.3
PB6
  Top 0.279: U3.20 20.19,37.83 18.29,39.73 JP2.2
PB7
  Top 0.279: 17.78,38.48 18.77,38.48 19.69,37.56 U3.21
  Top 0.305: JP2.4 18.29,41.78 17.02,40.51 17.02,39.24 17.78,38.48
PWRIN
  Top 0.813: D1.A 18.88,3.3 18.03,3.3 13.72,7.62 12.37,7.62 X1.2
  Bottom 0.813: X1.2 11.73,8.26
RD+
  Top 0.279: U3.29 16,34.42 14.35,36.07
  Top 0.305: 14.35,36.07 14.35,37.97 14.29,38.03 RN3.4
RD-
  Top 0.254: RN3.1 13.53,35.63
  Top 0.279: U3.30 15.34,33.92 RN3.1
RESET  (via drill 0.61)
  Top 0.305: C5.2 28.83,29.46 27.18,27.81 RESET-EN.1
  Top 0.406: RESET-EN.2 RESET-EN.1 | ICSP.5 63.64,23.25 62.87,22.48 ZU4.1 | POWER.3 32.51,3.05 32.51,7.49 28.57,11.43 28.57,21.34 29.08,21.84 30.23,21.84 31.11,22.73 31.11,24.89 RESET-EN.2 | RN1.4 28.61,27.85 RESET-EN.2 | RESET.3 2.88,47.66 3.68,46.86 8,46.86 8.76,47.62 v8.89,47.66 RESET.4 | RESET-EN.2 33.02,27.3 35.56,29.84 41.15,29.84 46.99,24 58.67,24 v59.44,24.77 D2.A | v30.23,29.34 30.23,28.83 RESET-EN.2
  Bottom 0.254: v8.89,47.66 9.89,48.67 10.05,48.64 12.7,48.64 15.11,46.23 16.38,46.23 17.02,46.86 17.02,48.01 17.8,48.79 21.82,48.79 23.88,46.74
  Bottom 0.305: 23.88,46.74 24.51,46.1 28.7,46.1 33.4,41.4 33.4,34.67 31.11,32.38 31.11,30.99 30.23,30.1 v30.23,29.34
  Bottom 0.406: v59.44,24.77 62.87,21.34 ZU4.1
RESET2  (via drill 0.61)
  Top 0.305: v22.61,46.61 22.61,47.62 21.46,48.77 17.02,48.77 ICSP1.5 13.51,47.5 D3.A 13.08,46.4 12.37,46.4 11.56,45.59 11.56,45.39 11.56,43.81 12.06,43.31 15.37,43.31 16.26,42.42 16.26,37.72 16.85,37.12 U3.24
  Top 0.406: RN1.6 26.18,24.28 26.16,24.26 v25.84,24.53 v25.83,24.54
  Bottom 0.406: v22.61,46.61 22.86,46.35 22.86,44.58 23.88,43.56 23.88,42.29 24.38,41.78 25.53,41.78 26.04,41.27 26.04,40.13 24,38.1 24,30.23 26.16,28.07 26.16,24.87 v25.83,24.54
RXLED
  Top 0.279: RX.C 25.02,34.29 24.15,33.42 U3.10
SCK  (via drill 0.61)
  Top 0.305: v26.92,21.46 25.15,21.46 23.75,22.86 18.03,22.86 16.94,21.76 U5.5
  Bottom 0.406: ICSP.3 62.1,26.42 62.1,24.77 65.02,21.84 65.02,17.4 62.99,15.37 46.48,15.37 45.59,14.48 41.53,14.48 40.01,12.95 | 40.01,12.95 40.01,13.97 38.73,15.24 31.75,15.24 30.23,16.76 29.34,16.76 27.81,18.29 27.81,20.07 26.92,20.95 v26.92,21.46 26.92,21.97 28.83,23.88 28.83,24.38 34.8,30.35 35.56,30.35 36.58,31.37 36.58,43.05 28.96,50.67 IOH.6 | 40.01,12.95 ZU4.19
SCK2
  Top 0.254: U3.15 23.48,35.92 24,36.45 24,43.56 21.34,46.23 20.32,46.23 19.05,47.5 ICSP1.3
SS  (via drill 0.61)
  Top 0.406: v33.53,26.04 33.78,25.78 33.78,23.93 33.68,23.82 33.68,18.82 32.38,17.53 ZU4.16
  Bottom 0.406: v33.53,26.04 34.42,26.92 36.45,26.92 39.5,29.97 39.5,47.5 36.58,50.42 IOH.3
TP_VUCAP
  Top 0.279: U3.27 16.98,35.42 15.62,36.78 | 15.62,40.51 15.62,41.27 14.99,41.91 C8.1
  Top 0.305: 15.62,36.78 15.62,40.51
TXLED
  Top 0.279: U3.11 23.51,33.92 26.16,36.58 TX.C
UGND
  Top 0.279: U3.28 16.51,34.92 14.99,36.45
  Top 0.305: 14.99,36.45 14.99,39.88 14.22,40.64
  Top 0.406: C8.2 11.81,41.27 12.45,40.64 14.22,40.64
  Top 0.61: L1.1 8.72,45 C8.2
  Top 0.813: L1.1 8.85,44.41 4.45,40.01 4.45,37.47 5.08,36.83 6.5,36.83 X2.4
  Bottom 0.61: X2.4 6.5,36.83
  Bottom 0.813: X2.4 5.06,36.85 4.45,37.47 4.45,40.01 5.71,41.27 10.03,41.27 GROUND.2
USBVCC
  Top 0.305: U3.31 16.78,33.42 16.64,33.27
  Top 0.406: 16.64,33.27 15.37,33.27 14.48,32.38 11.43,32.38 9.91,30.86 9.91,28.96 10.54,28.32 10.54,27.18 9.88,26.52 T1.1
  Top 0.813: 3.47,24.51 4.47,24.51 T1.1
USHIELD  (1 unrouted)
  Top 0.61: 9.02,42.8 9.02,42.67 11.7,39.99 Z1.2 | 11.06,33.54 11.19,33.54 11.3,33.66 Z2.2
  Top 0.813: L1.2 4.79,45.09 X2.P$1 | 11.06,33.54 5.25,33.54 X2.P$2
  Bottom 0.61: X2.P$1 5.11,42.8
  Bottom 0.813: X2.P$1 3.81,44.07 2.67,42.93 2.67,33.27 3.81,32.13 X2.P$2
VIN  (via drill 0.61)
  Top 0.305: RN1.8 24.82,22.68 24,23.5 17.53,23.5 15.24,21.21 15.24,19.3 14.8,18.86
  Top 0.61: 13.97,19.68 12.7,19.68 | 13.97,19.68 14.61,19.05 14.8,18.86 15.62,18.03 15.62,10.54 16.76,9.4 23.38,9.4 23.95,9.96 | 13.97,19.68 12.67,19.71 U1.3 | PC1.+ 25.54,11.43
  Top 0.813: v48.26,8.26 46.35,8.26 45.72,7.62 POWER.8 | D1.C 23.79,9.81 23.95,9.96 PC1.+ 25.53,10.79 27.81,8.51 v27.81,8
  Bottom 0.813: v48.26,8.26 47.75,8.26 47.24,7.75 28.07,7.75 v27.81,8
XT1
  Top 0.254: R1.1 18.29,29.72
  Top 0.279: 18.19,29.75 U3.1
  Top 0.305: R1.1 18.19,29.75
  Top 0.406: C9.1 16.89,26.67 16.51,26.67 Y1.2
  Top 0.61: C9.1 R1.1
XT2
  Top 0.279: 18.69,30.84 U3.2
  Top 0.305: R1.2 18.69,30.84
  Top 0.406: R1.2 C11.1 21.34,26.8 21.46,26.67 Y1.1
XTAL1
  Top 0.406: ZU4.9 42.55,22.35 R2.1 42.27,22.84 Y2.3
XTAL2
  Top 0.406: ZU4.10 40.01,22.35 R2.2 40.27,22.84 Y2.1
XUSB
  Top 0.813: F1.2 2.5,28.49 1.4,29.59 1.4,33.78 2.54,34.92 7.62,34.92 8.51,35.81 X2.1
  Bottom 0.305: X2.1 8.51,36.84

### Text on the board
Top: Use of the Arduino name must be compliant with http://www.arduino.cc/en/Main/Policy
Bottom: 2011-3-02
tPlace: MADE IN | ITALY | Prototype | Edition | Limited | 13 | 12 | 11 | 10 | 9 | 8 | 7 | 6 | 5 | 4 | 3 | 2 | 1 | 0
tNames: SCL | SDA | M.Banzi | D.Cuartielles | T.Igoe | AREF | GND | G.Martino | # | # | # | # | D.Mellis | # | # | DIGITAL | [#=PWM] | TX | RX | TM | TX | Arduino | RX | UNO | www.arduino.cc | 1 | ANALOG IN | IOREF | RESET | 3V3 | 5V | GND | VIN | A0 | A1 | A2 | A3 | A4 | A5
bNames: MADE IN | designed by | MADE IN | ITALY | tinker it | ITALY | designed by | tinker it | ATMEGA328
ReferenceLC: L | TX | ON | RX | PC1 | PC2
214bmp: D:/SmartProjects/Snc/a4_bn_logo2.bmp